# EasyEDA Pro project CogletESP_2026-02-24.epro, schematic CogletESPV1.1_3
Board Name: CogletESPV1.1_3; Create Date: 2025-12-19; Page Name: P1; Project Name: CogletESP; Schematic Name: CogletESPV1.1_3; Update Date: 2026-01-07; Company: EasyEDA.com; Page Size: A4; Version: V1.0
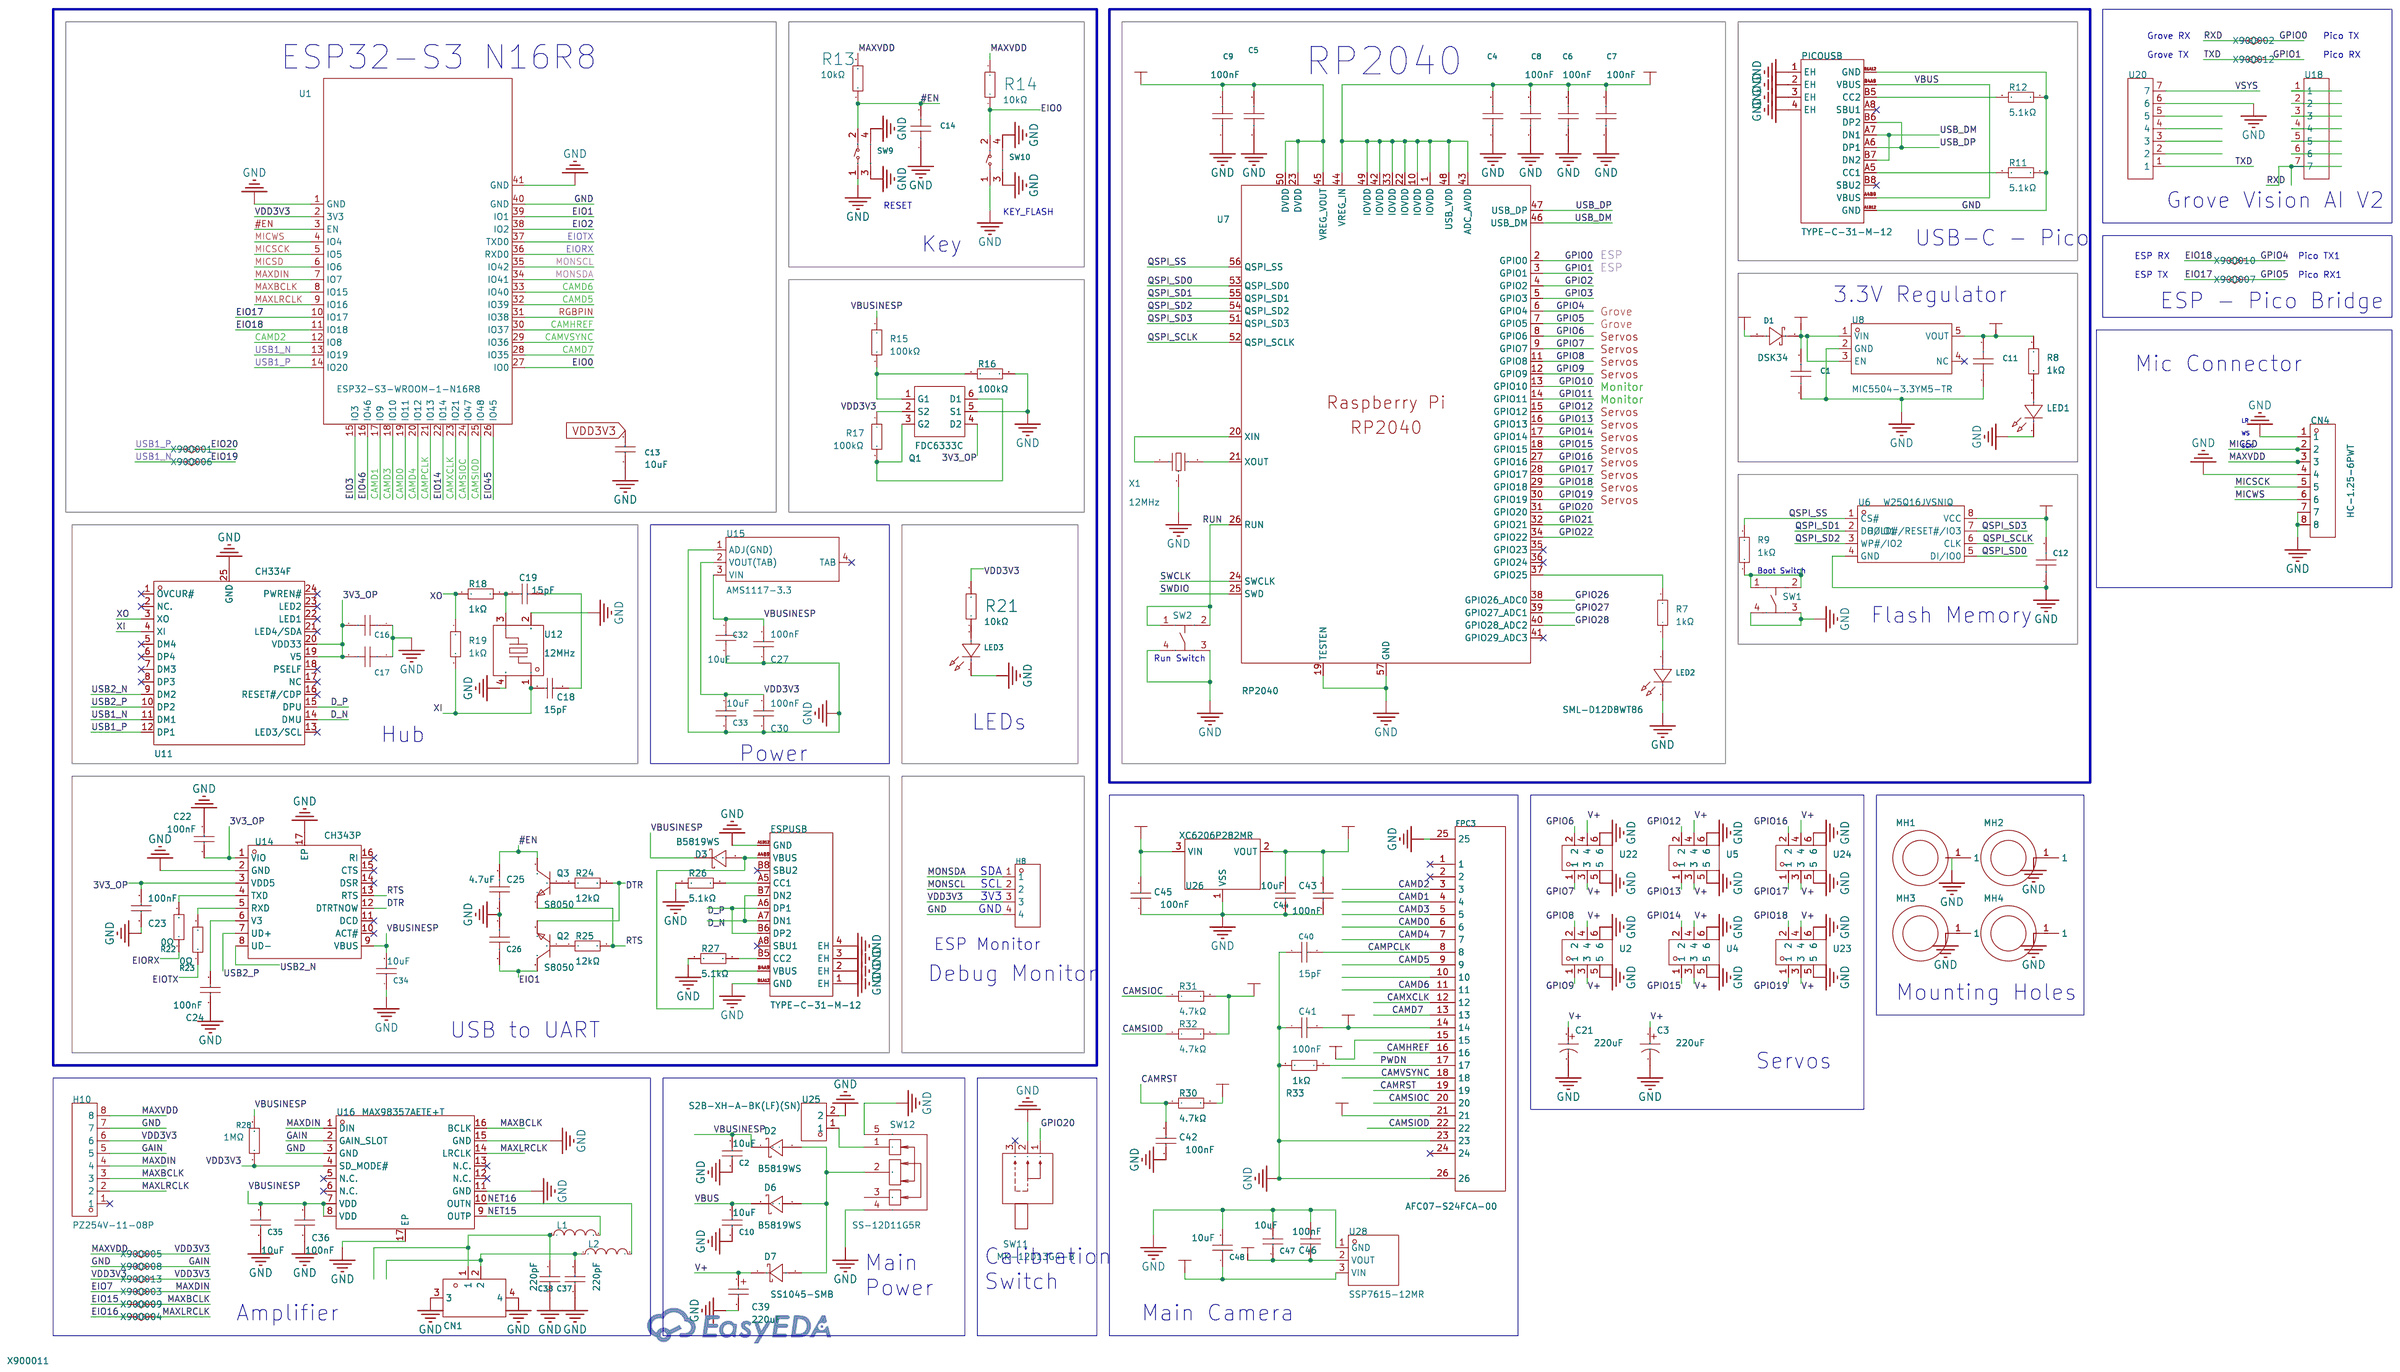
[diagram p2: schematic sheet]

## Parts
C1  1uF  [C0603]
C2  10uF  [C0603]
C3  220uF  [CAP-SMD_BD6.3-L6.6-W6.6-FD]
C4  1uF  [C0603]
C5  1uF  [C0603]
C6  100nF  [C0603]
C7  100nF  [C0603]
C8  100nF  [C0603]
C9  100nF  [C0603]
C10  10uF  [C0603]
C11  1uF  [C0603]
C12  1uF  [C0603]
C13  10uF  [C0805]
C14  1uF  [C0603]
C16  1uF  [C0603]
C17  1uF  [C0603]
C18  15pF  [C0603]
C19  15pF  [C0603]
C21  220uF  [CAP-SMD_BD6.3-L6.6-W6.6-FD]
C22  100nF  [C0603]
C23  100nF  [C0603]
C24  100nF  [C0603]
C25  4.7uF  [C0603]
C26  1uF  [C0603]
C27  100nF  [C0603]
C30  100nF  [C0603]
C32  10uF  [C0603]
C33  10uF  [C0603]
C34  10uF  [C0603]
C35  10uF  [C0603]
C36  100nF  [C0603]
C37  220pF  [C0603]
C38  220pF  [C0603]
C39  220uF  [CASE-B_3528]
C40  15pF  [C0603]
C41  100nF  [C0603]
C42  100nF  [C0603]
C43  100nF  [C0603]
C44  10uF  [C0603]
C45  100nF  [C0603]
C46  100nF  [C0603]
C47  10uF  [C0603]
C48  10uF  [C0603]
CN1  HC-1.25-2PWT  [CONN-SMD_2P-P1.25-HC-1.25-2PWT]
CN4  HC-1.25-6PWT  [CONN-SMD_6P-P1.25_HC-1.25-6PWT]
D1  DSK34  [SOD-123_L2.8-W1.8-LS3.7-RD]
D2  B5819WS  [SOD-323_L1.8-W1.3-LS2.5-RD]
D3  B5819WS  [SOD-323_L1.8-W1.3-LS2.5-RD]
D6  B5819WS  [SOD-323_L1.8-W1.3-LS2.5-RD]
D7  SS1045-SMB  [SMB_L4.4-W3.6-LS5.3-RD]
ESPUSB  TYPE-C-31-M-12  [USB-C_SMD-TYPE-C-31-M-12_1]
FPC3  AFC07-S24FCA-00  [FPC-SMD_AFC07-S24FCA-00]
H8  PZ254V-11-04P  [HDR-TH_4P-P2.54-V-M]
H10  PZ254V-11-08P  [HDR-TH_8P-P2.54-V-M]  (no BOM)
L1  BLM18PG121SN1D  [L0603]
L2  BLM18PG121SN1D  [L0603]
LED1  SML-D12P8WT86  [LED0603-RD_GREEN]
LED2  SML-D12D8WT86  [LED0603-R-RD_AMBER]
LED3  SML-D12D8WT86  [LED0603-R-RD_AMBER]
MH1  -  [2.5mm Mounting Hole]
MH2  -  [2.5mm Mounting Hole]
MH3  -  [2.5mm Mounting Hole]
MH4  -  [2.5mm Mounting Hole]
PICOUSB  TYPE-C-31-M-12  [USB-C_SMD-TYPE-C-31-M-12_1]
Q1  FDC6333C  [SOT-23-6_L2.9-W1.6-P0.95-LS2.8-BL]
Q2  S8050  [SOT-23-3_L3.0-W1.7-P0.95-LS2.9-BR]
Q3  S8050  [SOT-23-3_L3.0-W1.7-P0.95-LS2.9-BR]
R7  1kΩ  [R0603]
R8  1kΩ  [R0603]
R9  1kΩ  [R0603]
R11  5.1kΩ  [R0402]
R12  5.1kΩ  [R0402]
R13  10kΩ  [R0603]
R14  10kΩ  [R0603]
R15  100kΩ  [R0603]
R16  100kΩ  [R0603]
R17  100kΩ  [R0603]
R18  1kΩ  [R0603]
R19  1kΩ  [R0603]  (no BOM)
R21  10kΩ  [R0603]
R22  0Ω  [R0603]
R23  0Ω  [R0603]
R24  12kΩ  [R0603]
R25  12kΩ  [R0603]
R26  5.1kΩ  [R0402]
R27  5.1kΩ  [R0402]
R28  1MΩ  [R0603]
R30  4.7kΩ  [R0603]
R31  4.7kΩ  [R0603]
R32  4.7kΩ  [R0603]
R33  1kΩ  [R0603]
SW1  SKRPACE010  [KEY-SMD_4P-L4.2-W3.2-P2.20-LS4.6]
SW2  SKRPACE010  [KEY-SMD_4P-L4.2-W3.2-P2.20-LS4.6]
SW9  TC-6615-9.5-260G  [SW-TH_4P-L7.5-W9.5-P4.50]
SW10  TC-6615-9.5-260G  [SW-TH_4P-L7.5-W9.5-P4.50]
SW11  MK-12D13G4-B  [SW-TH_MK-12D13G4-B]
SW12  SS-12D11G5R  [SW-TH_SS-12D11G5R]
U1  ESP32-S3-WROOM-1-N16R8  [WIRELM-SMD_ESP32-S3-WROOM-1]
U2  HX PZ2.54-3x2P ZZ  [HDR-TH_6P-P2.54-V-M-R3-C2-S2.54_2]
U4  HX PZ2.54-3x2P ZZ  [HDR-TH_6P-P2.54-V-M-R3-C2-S2.54_2]
U5  HX PZ2.54-3x2P ZZ  [HDR-TH_6P-P2.54-V-M-R3-C2-S2.54_2]
U6  W25Q16JVSNIQ  [SOP-8_L4.9-W3.9-P1.27-LS6.0-BL]
U7  RP2040  [LQFN-56_L7.0-W7.0-P0.4-EP]
U8  MIC5504-3.3YM5-TR  [SOT-23-5_L3.0-W1.7-P0.95-LS2.8-TL]
U11  CH334F  [QFN-24_L4.0-W4.0-P0.50-BL-EP2.8]
U12  12MHz  [CRYSTAL-SMD_4P-L3.2-W2.5-BL]
U14  CH343P  [TQFN-16_L3.0-W3.0-P0.50-BL-EP1.7]
U15  AMS1117-3.3  [SOT-223-4_L6.5-W3.5-P2.30-LS7.0-BR]
U16  MAX98357AETE+T  [TQFN-16_L3.0-W3.0-P0.50-BL-EP1.5]
U18  HB-PH3-25417PB2GOP  [HDR-TH_7P-P2.54-V-M]
U20  HB-PH3-25417PB2GOP  [HDR-TH_7P-P2.54-V-M]  (no BOM)
U22  HX PZ2.54-3x2P ZZ  [HDR-TH_6P-P2.54-V-M-R3-C2-S2.54_2]
U23  HX PZ2.54-3x2P ZZ  [HDR-TH_6P-P2.54-V-M-R3-C2-S2.54_2]
U24  HX PZ2.54-3x2P ZZ  [HDR-TH_6P-P2.54-V-M-R3-C2-S2.54_2]
U25  S2B-XH-A-BK(LF)(SN)  [CONN-TH_S2B-XH-A-LF-SN]
U26  XC6206P282MR  [SOT-23-3_L2.9-W1.3-P0.95-LS2.4-BR]
U28  SSP7615-12MR  [SOT-23-3_L2.9-W1.6-P1.90-LS2.8-BR]
X1  12MHz  [CRYSTAL-SMD_3P-L3.2-W1.3-P1.2-BL]

## Library data of the parts
C1 C4 C5 C11 C12 C14 C16 C17 C26 = CL10A105KB8NNNC: Capacitance: Tolerance:±10% Tolerance:±10% Voltage Rated: Temperature Coefficient:; LCSC Part Name: 1uF ±10% 50V; Supplier Part: C15849; Manufacturer: SAMSUNG(三星); Supplier Footprint: 0603; JLCPCB Part Class: Basic Part; Datasheet: https://atta.szlcsc.com/upload/public/pdf/source/20160218/1457707763339.pdf; Supplier: LCSC; Tolerance: ±10%
C2 C10 C32-C35 C44 C47 C48 = CL10A106MO8NQNC: Capacitance:10uF Tolerance:±20% Tolerance:±20% Voltage Rating:16V Temperature Coefficient:X5R; LCSC Part Name: 10uF ±20% 16V; Supplier Part: C92487; Manufacturer: SAMSUNG(三星); Supplier Footprint: 0603; JLCPCB Part Class: Extended Part; Datasheet: https://item.szlcsc.com/datasheet/CL10A106MO8NQNC/93680.html; Supplier: LCSC; Tolerance: ±20%; Voltage Rating: 16V; Temperature Coefficient: X5R
C3 C21 = RVT1A221M0605_C72494: Capacitance: Tolerance:±20% Tolerance:±20% Voltage Rating: Ripple Current: Equivalent Series Resistance(ESR):- Diameter: Height - Seated (Max): Lifetime:2000hrs@105℃ Operating Temperature:-40℃~+105℃ Operating Temperature:-40℃~+105℃; LCSC Part Name: 220uF ±20% 10V; Supplier Part: C72494; Manufacturer: ROQANG(容强); Manufacturer Part: RVT1A221M0605; Supplier Footprint: SMD,D6.3xL5.4mm; JLCPCB Part Class: Extended Part; Datasheet: https://atta.szlcsc.com/upload/public/pdf/source/20170325/1490427950282.pdf; Supplier: LCSC; Tolerance: ±20%; Lifetime: 2000hrs@105℃; Operating Temperature: -40℃~+105℃
C6-C9 = CC0603KRX7R9BB104: Capacitance:100nF Tolerance:±10% Tolerance:±10% Voltage Rating:50V Temperature Coefficient:X7R; LCSC Part Name: 100nF ±10% 50V; Supplier Part: C14663; Manufacturer: YAGEO(国巨); Supplier Footprint: 0603; JLCPCB Part Class: Basic Part; Datasheet: https://item.szlcsc.com/datasheet/CC0603KRX7R9BB104/15331.html; Supplier: LCSC; Tolerance: ±10%; Temperature Coefficient: X7R; Voltage Rating: 50V
C13 = CL21A106KOQNNNE: Capacitance:10uF Tolerance:±10% Tolerance:±10% Voltage Rating:16V Temperature Coefficient:X5R; LCSC Part Name: 10uF ±10% 16V; Supplier Part: C1713; Manufacturer: SAMSUNG(三星); Supplier Footprint: 0805; JLCPCB Part Class: Extended Part; Datasheet: https://item.szlcsc.com/datasheet/CL21A106KOQNNNE/2065.html; Supplier: LCSC; Tolerance: ±10%; Voltage Rating: 16V; Temperature Coefficient: X5R
C18 C19 = CL10C150JB8NNNC: Capacitance:15pF Tolerance:±5% Tolerance:±5% Voltage Rating:50V Temperature Coefficient:C0G; LCSC Part Name: 15pF ±5% 50V; Supplier Part: C1644; Manufacturer: SAMSUNG(三星); Supplier Footprint: 0603; JLCPCB Part Class: Basic Part; Datasheet: https://item.szlcsc.com/datasheet/CL10C150JB8NNNC/1996.html; Supplier: LCSC; Tolerance: ±5%; Voltage Rating: 50V; Temperature Coefficient: C0G
C22-C24 C27 C30 C36 C41-C43 C45 C46 = CL10B104KA8NNNC: Capacitance:100nF Tolerance:±10% Tolerance:±10% Voltage Rating:25V Temperature Coefficient:X7R; LCSC Part Name: 100nF ±10% 25V; Supplier Part: C1590; Manufacturer: SAMSUNG(三星); Supplier Footprint: 0603; JLCPCB Part Class: Extended Part; Datasheet: https://item.szlcsc.com/datasheet/CL10B104KA8NNNC/1942.html; Supplier: LCSC; Tolerance: ±10%; Voltage Rating: 25V; Temperature Coefficient: X7R
C25 = CL10A475KO8NNNC: Capacitance:4.7uF Tolerance:±10% Tolerance:±10% Voltage Rating:16V Temperature Coefficient:X5R; LCSC Part Name: 4.7uF ±10% 16V; Supplier Part: C19666; Manufacturer: SAMSUNG(三星); Supplier Footprint: 0603; JLCPCB Part Class: Basic Part; Datasheet: https://item.szlcsc.com/datasheet/CL10A475KO8NNNC/20375.html; Supplier: LCSC; Tolerance: ±10%; Voltage Rating: 16V; Temperature Coefficient: X5R
C37 C38 = CL10B221KB8NNNC: Capacitance:220pF Tolerance:±10% Tolerance:±10% Voltage Rating:50V Temperature Coefficient:X7R; LCSC Part Name: 220pF ±10% 50V; Supplier Part: C1603; Manufacturer: SAMSUNG(三星); Supplier Footprint: 0603; JLCPCB Part Class: Basic Part; Datasheet: https://item.szlcsc.com/datasheet/CL10B221KB8NNNC/1955.html; Supplier: LCSC; Tolerance: ±10%; Voltage Rating: 50V; Temperature Coefficient: X7R
C39 = TLJB227M006R0500: Capacitance:220uF Tolerance:±20% Tolerance:±20% Voltage Rating:6.3V Equivalent Series Resistance(ESR):500mΩ@100kHz Operating Temperature:-55℃~+125℃ Operating Temperature:-55℃~+125℃; LCSC Part Name: 220uF ±20% 6.3V; Supplier Part: C30242; Manufacturer: Kyocera AVX; Supplier Footprint: CASE-B-3528-21(mm); JLCPCB Part Class: Extended Part; Supplier: LCSC; Tolerance: ±20%; Voltage Rating: 6.3V; Equivalent Series Resistance(ESR): 500mΩ@100kHz; Operating Temperature: -55℃~+125℃
C40 = CC0603JRNPO9BN150: Capacitance:15pF Tolerance:±5% Tolerance:±5% Voltage Rating:50V Temperature Coefficient:NP0; LCSC Part Name: 15pF ±5% 50V; Supplier Part: C107037; Manufacturer: YAGEO(国巨); Supplier Footprint: 0603; JLCPCB Part Class: Extended Part; Datasheet: https://item.szlcsc.com/datasheet/CC0603JRNPO9BN150/108253.html; Supplier: LCSC; Tolerance: ±5%; Voltage Rating: 50V; Temperature Coefficient: NP0
CN1 = HC-1.25-2PWT: Pins Structure:1x2P Pitch:1.25mm Mounting Style:Horizontal attachment Reference Series:PicoBlade(MX 1.25) Number of Pins:2P Number of Rows:1 Number of PINs Per Row:2 Row Spacing:- Current Rating (Max):1A Contact Material:Brass Contact Plating:Tin Operatin; LCSC Part Name: 1x2P 间距:1.25mm 卧贴 系列:PicoBlade(MX 1.25); Supplier Part: C2845379; Manufacturer: HCTL(华灿天禄); Supplier Footprint: SMD,P=1.25mm,卧贴; JLCPCB Part Class: Extended Part; Datasheet: https://atta.szlcsc.com/upload/public/pdf/source/20240930/9508A8292CCC87B0C29E3A028D56E30A.pdf; Supplier: LCSC; Pins Structure: 1x2P; Pitch: 1.25mm; Mounting Style: Horizontal attachment; Reference Series: PicoBlade(MX 1.25); Number of Pins: 2P; Number of Rows: 1; Number of PINs Per Row: 2; Current Rating (Max): 1A; Contact Material: Brass; Contact Plating: Tin; Operating Temperature Range: -40℃~+105℃; Rated Voltage (Max): 125V; Plastic Material: LCP; Flame Retardant Rating: UL94V-0; Supplementary Features: Auxiliary soldering legs; Z-Height of the Board: 3.57mm; X-Length of Bottom Edge on Board (Spacing Line): 7.55mm; Y-Width of Bottom Edge on Board: 5.25mm
CN4 = HC-1.25-6PWT: Pins Structure:1x6P Pitch:1.25mm Mounting Type:Surface Mount, Right Angle Reference Series:PicoBlade(MX 1.25) Number of Pins:6P Number of Rows:1 Number of PINs Per Row:6 Row Spacing:- Current Rating:1A Contact Material:Brass Contact Plating:Tin Operating; LCSC Part Name: 1x6P 间距:1.25mm 卧贴 系列:PicoBlade(MX 1.25); Supplier Part: C2845383; Manufacturer: HCTL(华灿天禄); Supplier Footprint: SMD,P=1.25mm,卧贴; JLCPCB Part Class: Extended Part; Datasheet: https://item.szlcsc.com/datasheet/HC-1.25-6PWT/3039064.html; Supplier: LCSC; Pins Structure: 1x6P; Pitch: 1.25mm; Mounting Type: Surface Mount, Right Angle; Reference Series: PicoBlade(MX 1.25); Number of Pins: 6P; Number of Rows: 1; Number of PINs Per Row: 6; Current Rating: 1A; Contact Material: Brass; Contact Plating: Tin; Operating Temperature: -40℃~+105℃; Voltage Rating: 125V; Plastic Material: LCP; Flame Retardant Rating: UL94V-0; Supplementary Features: Auxiliary Solder Pin; Z-Height of the Board: 3.57mm; X-Length of Bottom Edge on Board (Spacing Line): 12.55mm; Y-Width of Bottom Edge on Board: 5.25mm
D1 = DSK34_C41029: Diode Configuration:Independent Type Forward Voltage (Vf@If):550mV@3A Reverse Voltage (Vr):40V Rectified Current:3A Reverse Leakage Current (Ir):500uA@40V; LCSC Part Name: 电压:40V 电流:3A; Supplier Part: C41029; Manufacturer: MDD(辰达半导体); Supplier Footprint: SOD-123FL; JLCPCB Part Class: Extended Part; Datasheet: https://atta.szlcsc.com/upload/public/pdf/source/20240710/931B7979AEEE628A0AE48522F9F6A0BB.pdf; Supplier: LCSC; Diode Configuration: Independent Type; Forward Voltage (Vf@If): 550mV@3A; Reverse Voltage (Vr): 40V; Rectified Current: 3A; Reverse Leakage Current (Ir): 500uA@40V
D2 D3 D6 = B5819WS_C64886: Diode Configuration:Independent Voltage - Forward(Vf@If):900mV@3A Voltage - DC Reverse(Vr):40V Current - Rectified:1A Reverse Leakage Current (Ir):1mA@40V Operating Junction Temperature Range:-55℃~+125℃ Operating Junction Temperature Range:-55℃~+125℃ Non-; LCSC Part Name: 丝印SL 电压:40V 电流:1A; Supplier Part: C64886; Manufacturer: MDD(辰达半导体); Supplier Footprint: SOD-323; JLCPCB Part Class: Extended Part; Datasheet: https://item.szlcsc.com/datasheet/B5819WS/65956.html; Supplier: LCSC; Diode Configuration: Independent; Voltage - Forward(Vf@If): 900mV@3A; Voltage - DC Reverse(Vr): 40V; Current - Rectified: 1A; Reverse Leakage Current (Ir): 1mA@40V; Operating Junction Temperature Range: -55℃~+125℃; Non-Repetitive Peak Forward Surge Current: 25A
D7 = SS1045-SMB: Diode Configuration:Independent Type Voltage - Forward(Vf@If):550mV@10A Voltage - DC Reverse(Vr):45V Current - Rectified:10A Reverse Leakage Current (Ir):100nA; LCSC Part Name: 电压:45V 电流:10A; Supplier Part: C2903947; Manufacturer: GOODWORK(固得沃克); Supplier Footprint: SMB(DO-214AA); JLCPCB Part Class: Extended Part; Datasheet: https://atta.szlcsc.com/upload/public/pdf/source/20240617/4C132C80E36BDBE9AB2C039856844535.pdf; Supplier: LCSC; Diode Configuration: Independent Type; Voltage - Forward(Vf@If): 550mV@10A; Voltage - DC Reverse(Vr): 45V; Current - Rectified: 10A; Reverse Leakage Current (Ir): 100nA
ESPUSB PICOUSB = TYPE-C-31-M-12: Connector Type:Type-C Protocol Standard:- Gender:Female Mounting Type:- Number of Contacts:16P Number of Ports:1 Current Rating-Power:5A Operating Temperature:- Operating Temperature:-; LCSC Part Name: Type-C 母; Supplier Part: C165948; Manufacturer: 韩国韩荣; Supplier Footprint: SMD; JLCPCB Part Class: Extended Part; Datasheet: https://item.szlcsc.com/datasheet/TYPE-C-31-M-12/177331.html; Supplier: LCSC; Connector Type: Type-C; Gender: Female; Number of Contacts: 16P; Number of Ports: 1; Current Rating-Power: 5A
FPC3 = AFC07-S24FCA-00: Locking Feature:Slide Lock Contact Type:Bottom Contact Number of Contacts:24P Pitch:0.5mm Mounting Type:Surface Mount, Right Angle FFC, FCB Thickness:0.3mm FFC, FCB Thickness:0.3mm Height Above Board:2mm Contact Material:Copper Alloy Contact Plating:Tin; LCSC Part Name: 抽屉式 下接 P数:24P 间距:0.5mm; Supplier Part: C262567; Manufacturer: JS(钜硕电子); Supplier Footprint: SMD,P=0.5mm,卧贴; JLCPCB Part Class: Extended Part; Datasheet: https://item.szlcsc.com/datasheet/AFC07-S24FCA-00/253876.html; Supplier: LCSC; Locking Feature: Slide Lock; Contact Type: Bottom Contact; Number of Contacts: 24P; Pitch: 0.5mm; Mounting Type: Surface Mount, Right Angle; FFC, FCB Thickness: 0.3mm; Height Above Board: 2mm; Contact Material: Copper Alloy; Contact Plating: Tin
H8 = PZ254V-11-04P: Pin Structure:1x4P Pitch:2.54mm Row Spacing:- Circluar Pins/Square Pins:Pin Header Mounting Type:Through Hole Number of Rows:1 Number of Pins:4P Current Rating:3A Voltage Rating (Max):250V Length of Mating Pin:6mm Insulation Height:2.5mm Length of End Con; LCSC Part Name: 1x4P 间距:2.54mm 方针 直插; Supplier Part: C2691448; Manufacturer: XFCN(兴飞); Supplier Footprint: 插件,P=2.54mm; JLCPCB Part Class: Extended Part; Datasheet: https://item.szlcsc.com/datasheet/PZ254V-11-04P/2801085.html; Supplier: LCSC; Pin Structure: 1x4P; Pitch: 2.54mm; Circluar Pins/Square Pins: Pin Header; Mounting Type: Through Hole; Number of Rows: 1; Number of Pins: 4P; Current Rating: 3A; Voltage Rating (Max): 250V; Length of Mating Pin: 6mm; Insulation Height: 2.5mm; Length of End Connection Pin: 3mm; Operating Temperature: -40℃~+105℃; Color: Black
H10 = PZ254V-11-08P: Pin Structure:1x8P Pitch:2.54mm Row Spacing:- Circluar Pins/Square Pins:Pin Header Mounting Type:Through Hole Number of Rows:1 Number of Pins:8P Current Rating:- Voltage Rating (Max):- Length of Mating Pin:6mm Insulation Height:2.5mm Length of End Connect; LCSC Part Name: 1x8P 间距:2.54mm 方针 直插; Supplier Part: C492407; Manufacturer: XFCN(兴飞); Supplier Footprint: 插件,P=2.54mm; JLCPCB Part Class: Extended Part; Datasheet: https://item.szlcsc.com/datasheet/PZ254V-11-08P/502963.html; Supplier: LCSC; Pin Structure: 1x8P; Pitch: 2.54mm; Circluar Pins/Square Pins: Pin Header; Mounting Type: Through Hole; Number of Rows: 1; Number of Pins: 8P; Length of Mating Pin: 6mm; Insulation Height: 2.5mm; Length of End Connection Pin: 3mm; Contact Material: Brass; Operating Temperature: -40℃~+105℃; Color: Black
L1 L2 = BLM18PG121SN1D_C14709: Impedance @ Frequency:120Ω@100MHz Tolerance:±25% Tolerance:±25% DC Resistance(DCR):50mΩ Current Rating:2A Number of Circuits:1 Operating Temperature:-55℃~+125℃ Operating Temperature:-55℃~+125℃; LCSC Part Name: 单路 0603磁珠 阻抗120Ω@100MHz; Supplier Part: C14709; Manufacturer: muRata(村田); Supplier Footprint: 0603; JLCPCB Part Class: Basic Part; Datasheet: https://item.szlcsc.com/datasheet/BLM18PG121SN1D/15379.html; Supplier: LCSC; Impedance @ Frequency: 120Ω@100MHz; Tolerance: ±25%; DC Resistance(DCR): 50mΩ; Current Rating: 2A; Number of Circuits: 1; Operating Temperature: -55℃~+125℃
LED1 = SML-D12P8WT86: Emitted Color:Green-yellow Forward Voltage (VF):2.2V Forward Voltage (VF):2.2V Power Dissipation:54mW Forward Current:20mA Dominant Wavelength:560nm Dominant Wavelength:560nm Peak Wavelength:- Diode Configuration:- Lens Color:白色透镜 Color Temperature:- Colo; LCSC Part Name: 普绿/黄绿; Supplier Part: C510026; Manufacturer: ROHM(罗姆); Supplier Footprint: 0603; JLCPCB Part Class: Extended Part; Datasheet: https://atta.szlcsc.com/upload/public/pdf/source/20201028/C510025_17C36021E4F76BF48F6AD66EDB30A43C.pdf; Supplier: LCSC; Emitted Color: Green-yellow; Forward Voltage (VF): 2.2V; Power Dissipation: 54mW; Forward Current: 20mA; Dominant Wavelength: 560nm; Lens Color: 白色透镜; Luminous Intensity: 6.3mcd; Operating Temperature: -40℃~+85℃
LED2 LED3 = SML-D12D8WT86: Emitted Color:Amber Color Forward Voltage (VF):2.2V Forward Voltage (VF):2.2V Power Dissipation:54mW Forward Current:20mA Dominant Wavelength:605nm Dominant Wavelength:605nm Peak Wavelength:- Diode Configuration:- Lens Color:白色透镜 Color Temperature:- Color; LCSC Part Name: 琥珀; Supplier Part: C510024; Manufacturer: ROHM(罗姆); Supplier Footprint: 0603; JLCPCB Part Class: Extended Part; Datasheet: https://atta.szlcsc.com/upload/public/pdf/source/20201028/C510025_17C36021E4F76BF48F6AD66EDB30A43C.pdf; Supplier: LCSC; Emitted Color: Amber Color; Forward Voltage (VF): 2.2V; Power Dissipation: 54mW; Forward Current: 20mA; Dominant Wavelength: 605nm; Lens Color: 白色透镜; Luminous Intensity: 100mcd; Operating Temperature: -40℃~+85℃
MH1-MH4 = 2.5mmHole
Q1 = FDC6333C_C5182070: Drain to Source Voltage:30V；30V Current - Continuous Drain(Id):4A；3A RDS(on):30mΩ@10V；45mΩ@10V Gate Threshold Voltage (Vgs(th)):1.6V@250uA；1.5V@250uA Gate Charge(Qg):5nC@10V；5nC@10V Input Capacitance(Ciss):199pF；210pF Reverse Transfer Capacitance (Crss@Vd; LCSC Part Name: N沟道和P沟道增强型功率MOSFET; Supplier Part: C5182070; Manufacturer: TECH PUBLIC(台舟); Supplier Footprint: SOT-23-6; JLCPCB Part Class: Extended Part; Datasheet: https://item.szlcsc.com/datasheet/FDC6333C/5842210.html; Supplier: LCSC; Drain to Source Voltage: 30V；30V; Current - Continuous Drain(Id): 4A；3A; RDS(on): 30mΩ@10V；45mΩ@10V; Gate Threshold Voltage (Vgs(th)): 1.6V@250uA；1.5V@250uA; Gate Charge(Qg): 5nC@10V；5nC@10V; Input Capacitance(Ciss): 199pF；210pF; Reverse Transfer Capacitance (Crss@Vds): 23pF；28pF; Operating Temperature: -55℃~+150℃; Type: N-Channel + P-Channel; Output Capacitance(Coss): 35pF；47pF
Q2 Q3 = S8050 J3Y(RANGE:200-350): type:NPN Current - Collector(Ic):500mA Collector - Emitter Voltage VCEO:25V Pd - Power Dissipation:300mW DC Current Gain:200@500mA,1V DC Current Gain:200@500mA,1V Transition frequency(fT):150MHz Current - Collector Cutoff:100nA Vce Saturation(VCE(sat)):60; LCSC Part Name: H档(200-350) NPN 电流:0.5A 电压:25V; Supplier Part: C2146; Manufacturer: CJ(江苏长电/长晶); Supplier Footprint: SOT-23; JLCPCB Part Class: Basic Part; Datasheet: https://item.szlcsc.com/datasheet/S8050%2520J3Y(RANGE%253A200-350)/2503.html; Supplier: LCSC; type: NPN; Current - Collector(Ic): 500mA; Collector - Emitter Voltage VCEO: 25V; Pd - Power Dissipation: 300mW; DC Current Gain: 200@500mA,1V; Transition frequency(fT): 150MHz; Current - Collector Cutoff: 100nA; Vce Saturation(VCE(sat)): 600mV@500mA,50mA; Operating Temperature: -55℃~+150℃; Emitter-Base Voltage(Vebo): 5V; Number: 1 NPN
R7-R9 R18 R19 R33 = RC0603JR-071KL: Type:Thick Film Resistors Resistance: Tolerance:±5% Tolerance:±5% Power(Watts): Overload Voltage (Max): Temperature Coefficient:±100ppm/℃ Temperature Coefficient:±100ppm/℃ Operating Temperature Range:-55℃~+155℃ Operating Temperature Range:-55℃~+155℃; LCSC Part Name: 厚膜电阻 1kΩ ±5% 100mW; Supplier Part: C14676; Manufacturer: YAGEO(国巨); Supplier Footprint: 0603; JLCPCB Part Class: Extended Part; Datasheet: https://atta.szlcsc.com/upload/public/pdf/source/20180312/878C51D17DCD6F9A3FE54FC2E3312A77.pdf; Supplier: LCSC; Type: Thick Film Resistors; Tolerance: ±5%; Temperature Coefficient: ±100ppm/℃; Operating Temperature Range: -55℃~+155℃
R11 R12 R26 R27 = 0402WGF5101TCE: Type:Thick Film Resistors Resistance:5.1kΩ Tolerance:±1% Tolerance:±1% Power(Watts): Overload Voltage (Max): Temperature Coefficient:±100ppm/℃ Temperature Coefficient:±100ppm/℃ Operating Temperature Range:-55℃~+155℃ Operating Temperature Range:-55℃~+155℃; LCSC Part Name: 5.1kΩ ±1% 62.5mW 厚膜电阻; Supplier Part: C25905; Manufacturer: UNI-ROYAL(厚声); Supplier Footprint: 0402; JLCPCB Part Class: Basic Part; Datasheet: https://atta.szlcsc.com/upload/public/pdf/source/20200306/C422600_1E6D84923E4A46A82E41ADD87F860B5C.pdf; Supplier: LCSC; Type: Thick Film Resistors; Tolerance: ±1%; Temperature Coefficient: ±100ppm/℃; Operating Temperature Range: -55℃~+155℃
R13 R14 R21 = 0603WAF1002T5E: Type:Thick Film Resistor Resistance:10kΩ Tolerance:±1% Tolerance:±1% Power(Watts):100mW Voltage-Supply(Max):75V Temperature Coefficient:±100ppm/℃ Temperature Coefficient:±100ppm/℃ Operating Temperature:-55℃~+155℃ Operating Temperature:-55℃~+155℃; LCSC Part Name: 厚膜电阻 10kΩ ±1% 100mW; Supplier Part: C25804; Manufacturer: UNI-ROYAL(厚声); Supplier Footprint: 0603; JLCPCB Part Class: Basic Part; Datasheet: https://item.szlcsc.com/datasheet/0603WAF1002T5E/26547.html; Supplier: LCSC; Type: Thick Film Resistor; Tolerance: ±1%; Power(Watts): 100mW; Voltage-Supply(Max): 75V; Temperature Coefficient: ±100ppm/℃; Operating Temperature: -55℃~+155℃
R15-R17 = 0603WAF1003T5E: Type:Thick Film Resistor Resistance:100kΩ Tolerance:±1% Tolerance:±1% Power(Watts):100mW Voltage-Supply(Max):75V Temperature Coefficient:±100ppm/℃ Temperature Coefficient:±100ppm/℃ Operating Temperature:-55℃~+155℃ Operating Temperature:-55℃~+155℃; LCSC Part Name: 100kΩ ±1% 100mW 厚膜电阻; Supplier Part: C25803; Manufacturer: UNI-ROYAL(厚声); Supplier Footprint: 0603; JLCPCB Part Class: Basic Part; Datasheet: https://item.szlcsc.com/datasheet/0603WAF1003T5E/26546.html; Supplier: LCSC; Type: Thick Film Resistor; Tolerance: ±1%; Power(Watts): 100mW; Voltage-Supply(Max): 75V; Temperature Coefficient: ±100ppm/℃; Operating Temperature: -55℃~+155℃
R22 R23 = 0603WAJ0000T5E: Type:Thick Film Resistor Resistance:0Ω Tolerance:±5% Tolerance:±5% Power(Watts):100mW Voltage-Supply(Max):75V Temperature Coefficient:±800ppm/℃ Temperature Coefficient:±800ppm/℃ Operating Temperature:-55℃~+155℃ Operating Temperature:-55℃~+155℃; LCSC Part Name: 0Ω ±5% 100mW 厚膜电阻; Supplier Part: C15402; Manufacturer: UNI-ROYAL(厚声); Supplier Footprint: 0603; JLCPCB Part Class: Extended Part; Datasheet: https://item.szlcsc.com/datasheet/0603WAJ0000T5E/16080.html; Supplier: LCSC; Type: Thick Film Resistor; Tolerance: ±5%; Power(Watts): 100mW; Voltage-Supply(Max): 75V; Temperature Coefficient: ±800ppm/℃; Operating Temperature: -55℃~+155℃
R24 R25 = 0603WAF1202T5E: Type:Thick Film Resistor Resistance:12kΩ Tolerance:±1% Tolerance:±1% Power(Watts):100mW Voltage-Supply(Max):75V Temperature Coefficient:±100ppm/℃ Temperature Coefficient:±100ppm/℃ Operating Temperature:-55℃~+155℃ Operating Temperature:-55℃~+155℃; LCSC Part Name: 12kΩ ±1% 100mW 厚膜电阻; Supplier Part: C22790; Manufacturer: UNI-ROYAL(厚声); Supplier Footprint: 0603; JLCPCB Part Class: Basic Part; Datasheet: https://item.szlcsc.com/datasheet/0603WAF1202T5E/23517.html; Supplier: LCSC; Type: Thick Film Resistor; Tolerance: ±1%; Power(Watts): 100mW; Voltage-Supply(Max): 75V; Temperature Coefficient: ±100ppm/℃; Operating Temperature: -55℃~+155℃
R28 = 0603WAF1004T5E: Type:Thick Film Resistors Resistance:1MΩ Tolerance:±1% Tolerance:±1% Power(Watts): Overload Voltage (Max): Temperature Coefficient:±100ppm/℃ Temperature Coefficient:±100ppm/℃ Operating Temperature Range:-55℃~+155℃ Operating Temperature Range:-55℃~+155℃; LCSC Part Name: 1MΩ ±1% 100mW 厚膜电阻; Supplier Part: C22935; Manufacturer: UNI-ROYAL(厚声); Supplier Footprint: 0603; JLCPCB Part Class: Basic Part; Datasheet: https://atta.szlcsc.com/upload/public/pdf/source/20200306/C422600_1E6D84923E4A46A82E41ADD87F860B5C.pdf; Supplier: LCSC; Type: Thick Film Resistors; Tolerance: ±1%; Temperature Coefficient: ±100ppm/℃; Operating Temperature Range: -55℃~+155℃
R30-R32 = 0603WAF4701T5E: Type:Thick Film Resistor Resistance:4.7kΩ Tolerance:±1% Tolerance:±1% Power(Watts):100mW Voltage-Supply(Max):75V Temperature Coefficient:±100ppm/℃ Temperature Coefficient:±100ppm/℃ Operating Temperature:-55℃~+155℃ Operating Temperature:-55℃~+155℃; LCSC Part Name: 4.7kΩ ±1% 100mW 厚膜电阻; Supplier Part: C23162; Manufacturer: UNI-ROYAL(厚声); Supplier Footprint: 0603; JLCPCB Part Class: Basic Part; Datasheet: https://item.szlcsc.com/datasheet/0603WAF4701T5E/23889.html; Supplier: LCSC; Type: Thick Film Resistor; Tolerance: ±1%; Power(Watts): 100mW; Voltage-Supply(Max): 75V; Temperature Coefficient: ±100ppm/℃; Operating Temperature: -55℃~+155℃
SW1 SW2 = SKRPACE010: Circuit:SPST Actuator Style:Oval button Mounting Style:Brick nogging Switch Length:4.2mm Switch Width:3.2mm Switch Height:2.5mm Contact Current:50mA Voltage Rating (DC):16V With Lamp:- Mechanical Life:-; LCSC Part Name: 4.2*3.2*2.5mm 立贴 轻触开关; Supplier Part: C139797; Manufacturer: ALPSALPINE(阿尔卑斯阿尔派); Supplier Footprint: SMD; JLCPCB Part Class: Extended Part; Datasheet: https://atta.szlcsc.com/upload/public/pdf/source/20171113/C139797_15105612676371115729.pdf; Supplier: LCSC; Circuit: SPST; Actuator Style: Oval button; Mounting Style: Brick nogging; Switch Length: 4.2mm; Switch Width: 3.2mm; Switch Height: 2.5mm; Contact Current: 50mA; Voltage Rating (DC): 16V
SW9 SW10 = TC-6615-9.5-260G: Circuit:SPST Actuator Style:Round Button Operating Force:2.6N Mounting Type:Right Angle Length:6mm Width:6mm Switch Height:9.5mm with Bracket:With Bracket Contact Current:50mA Voltage Rating:12V Actuator/Cap Color:Black With Lamp:No IP Rating:- Terminatio; LCSC Part Name: 轻触6*6*9.5支架 插件260g; Supplier Part: C2845278; Manufacturer: HCTL(华灿天禄); Supplier Footprint: 插件; JLCPCB Part Class: Extended Part; Datasheet: https://item.szlcsc.com/datasheet/TC-6615-9.5-260G/3038945.html; Supplier: LCSC; Circuit: SPST; Actuator Style: Round Button; Operating Force: 2.6N; Mounting Type: Right Angle; Length: 6mm; Width: 6mm; Switch Height: 9.5mm; with Bracket: With Bracket; Contact Current: 50mA; Voltage Rating: 12V; Actuator/Cap Color: Black; With Lamp: No; Life: 100,000 Cycles; Operating Temperature: -25℃~+85℃
SW11 = MK-12D13G4-B: Circuit:SPDT Actuator Style:Rectangular Columnar Termination Style:PC Pin Length:8.5mm Width:3.5mm Mounting Type:Right Angle Current Rating:300mA Voltage Rating:12V Life:10,000 Cycles; LCSC Part Name: mini拨动开关; Supplier Part: C20611678; Manufacturer: HOOYA(皓宇电子); Supplier Footprint: 插件,P=2.5mm; JLCPCB Part Class: Extended Part; Datasheet: https://item.szlcsc.com/datasheet/MK-12D13G4-B/21966525.html; Supplier: LCSC; Circuit: SPDT; Actuator Style: Rectangular Columnar; Termination Style: PC Pin; Length: 8.5mm; Width: 3.5mm; Mounting Type: Right Angle; Current Rating: 300mA; Voltage Rating: 12V; Life: 10,000 Cycles
SW12 = SS-12D11G5R: Circuit:SPDT Actuator Style:Rectangular Columnar Termination Style:PC Pin Length:- Width:- Switch Height:- Mounting Type:Right Angle Actuator Color:Black Current Rating:3A Voltage Rating:125V Life:10,000 Cycles Operating Temperature:-40℃~+85℃ Operating Te; LCSC Part Name: 柄长5mm 弯插双档 滑动开关; Supplier Part: C388633; Manufacturer: XKB Connection(中国星坤); Supplier Footprint: 插件; JLCPCB Part Class: Extended Part; Datasheet: https://item.szlcsc.com/datasheet/SS-12D11G5R/363903.html; Supplier: LCSC; Circuit: SPDT; Actuator Style: Rectangular Columnar; Termination Style: PC Pin; Mounting Type: Right Angle; Actuator Color: Black; Current Rating: 3A; Voltage Rating: 125V; Life: 10,000 Cycles; Operating Temperature: -40℃~+85℃
U1 = ESP32-S3-WROOM-1-N16R8: LCSC Part Name: 通用型Wi-Fi+低功耗蓝牙MCU模组; Supplier Part: C2913202; Manufacturer: ESPRESSIF(乐鑫); Supplier Footprint: SMD,25.5x18mm; JLCPCB Part Class: Extended Part; Datasheet: https://item.szlcsc.com/datasheet/ESP32-S3-WROOM-1-N16R8/3198300.html; Supplier: LCSC
U2 U4 U5 U22-U24 = HX PZ2.54-3x2P ZZ: Pin Structure:3x2P Pitch:2.54mm Row Spacing:2.54mm Circluar Pins/Square Pins:Pin Header Mounting Type:Through Hole Number of Rows:3 Number of Pins:6P Current Rating:3A Voltage Rating (Max):1kV Length of Mating Pin:6mm Insulation Height:2.5mm Length of End; LCSC Part Name: 3x2P 间距:2.54mm 方针 直插; Supplier Part: C32713289; Manufacturer: hanxia(韩下); Supplier Footprint: 插件,P=2.54mm; JLCPCB Part Class: Extended Part; Datasheet: https://item.szlcsc.com/datasheet/HX%2520PZ2.54-3x2P%2520ZZ/34444569.html; Supplier: LCSC; Pin Structure: 3x2P; Pitch: 2.54mm; Row Spacing: 2.54mm; Circluar Pins/Square Pins: Pin Header; Mounting Type: Through Hole; Number of Rows: 3; Number of Pins: 6P; Current Rating: 3A; Voltage Rating (Max): 1kV; Length of Mating Pin: 6mm; Insulation Height: 2.5mm; Length of End Connection Pin: 3mm; Contact Material: Brass; Contact Plating: Gold; Operating Temperature: -40℃~+105℃; Color: Black
U6 = W25Q16JVSNIQ_C2456211: Supplier Part: C2456211; Manufacturer: WINBOND(华邦); Supplier Footprint: SOIC-8; JLCPCB Part Class: Extended Part; Datasheet: https://atta.szlcsc.com/upload/public/pdf/source/20190529/C115407_78E5B4F96E7138D299EC51EC5982A1A5.pdf; Supplier: LCSC
U7 = RP2040_C2040: CPU Core:- RAM Size:264KB GPIO Ports Number:30 Operating Voltage Range:- Operating Voltage Range:- CPU Maximum Speed:133MHz Program Memory Type:- Operating Temperature Range:- Operating Temperature Range:- ADC (Bit):12bit DAC (Bit):- PWM (Bit):- 8Bit Time; LCSC Part Name: RP2040（RP2B2）; Supplier Part: C2040; Manufacturer: Raspberry Pi(树莓派); Supplier Footprint: LQFN-56(7x7); JLCPCB Part Class: Extended Part; Datasheet: https://atta.szlcsc.com/upload/public/pdf/source/20210621/C2040_96F425825606B7957D87DD32E2512CA9.pdf; Supplier: LCSC; RAM Size: 264KB; GPIO Ports Number: 30; CPU Maximum Speed: 133MHz; ADC (Bit): 12bit; UART/USART: 2; I2C: 2; SPI: 2; Universal Serial Bus: 有; Peripheral/Function: DMA；PWM; Direct Memory Access: 有
U8 = MIC5504-3.3YM5-TR: Output Type: Maximum Input Voltage:5.5V Output Voltage:3.3V Output Voltage:3.3V MAX Output Current:300mA Power Supply Rejection Ratio (PSRR):60dB@(1kHz) Dropout Voltage:380mV@(300mA) standby current:55uA Operating Temperature:-40℃~+125℃ Operating Temperat; LCSC Part Name: 输入5.5V 输出3.3V 300mA; Supplier Part: C88419; Manufacturer: MICROCHIP(美国微芯); Supplier Footprint: SOT-23-5; JLCPCB Part Class: Extended Part; Datasheet: https://atta.szlcsc.com/upload/public/pdf/source/20180329/C95749_2D03E2CDCEE40DDAAF1BC13608301412.pdf; Supplier: LCSC; Maximum Input Voltage: 5.5V; Output Voltage: 3.3V; MAX Output Current: 300mA; Power Supply Rejection Ratio (PSRR): 60dB@(1kHz); Dropout Voltage: 380mV@(300mA); standby current: 55uA; Operating Temperature: -40℃~+125℃; Output Polarity: Positive electrode; Number of Outputs: 1
U11 = CH334F_C5187527: type:Hub USB Protocol:USB 2.0 Data Rate:480Mbps Voltage - Supply:5V；3.3V Voltage - Supply:5V；3.3V Operating Temperature:-40℃~+85℃ Operating Temperature:-40℃~+85℃; Supplier Part: C5187527; Manufacturer: WCH(南京沁恒); Supplier Footprint: QFN-24(4x4); JLCPCB Part Class: Extended Part; Datasheet: https://item.szlcsc.com/datasheet/CH334F/5860925.html; Supplier: LCSC; type: Hub; USB Protocol: USB 2.0; Data Rate: 480Mbps; Voltage - Supply: 5V；3.3V; Operating Temperature: -40℃~+85℃
U12 = SX3B12.000F1510F30: Type:Crystal Oscillator Frequency:12MHz Normal temperature Frequency Tolerance:±10ppm Normal temperature Frequency Tolerance:±10ppm Load Capacitance:15pF Frequency Stability:±30ppm Frequency Stability:±30ppm Equivalent Series Resistance(ESR):100Ω Operatin; LCSC Part Name: 12MHz ±10ppm 15pF; Supplier Part: C2901651; Manufacturer: SCTF(星通时频); Supplier Footprint: SMD3225-4P; JLCPCB Part Class: Extended Part; Datasheet: https://item.szlcsc.com/datasheet/SX3B12.000F1510F30/3151464.html; Supplier: LCSC; Type: Crystal Oscillator; Normal temperature Frequency Tolerance: ±10ppm; Load Capacitance: 15pF; Frequency Stability: ±30ppm; Equivalent Series Resistance(ESR): 100Ω; Operating Temperature: -40℃~+85℃
U14 = CH343P: Applications Function:USB to UART USB Protocol:USB 2.0 Number of Channels:- Voltage - Supply:3.3V；5V Voltage - Supply:3.3V；5V Data Rate:6Mbps Operating Temperature:-40℃~+85℃ Operating Temperature:-40℃~+85℃; Supplier Part: C2846043; Manufacturer: WCH(南京沁恒); Supplier Footprint: TQFN-16-EP(3x3); JLCPCB Part Class: Extended Part; Datasheet: https://item.szlcsc.com/datasheet/CH343P/3039795.html; Supplier: LCSC; Applications Function: USB to UART; USB Protocol: USB 2.0; Voltage - Supply: 3.3V；5V; Data Rate: 6Mbps; Operating Temperature: -40℃~+85℃
U15 = AMS1117-3.3_C347222: Output Type:Fixed Voltage - Supply:12V Output Voltage:3.3V Output Voltage:3.3V Output Current:1A Power Supply Rejection Ratio (PSRR):60dB@(120Hz) Voltage Dropout:1.3V@(1A) standby current:5mA Noise:0.003%Vout Features:Over Current Protection Operating Tem; LCSC Part Name: 输出:3.3V 电流:1A 耐压:12V; Supplier Part: C347222; Manufacturer: UMW(友台半导体); Supplier Footprint: SOT-223; JLCPCB Part Class: Extended Part; Datasheet: https://item.szlcsc.com/datasheet/AMS1117-3.3/323882.html; Supplier: LCSC; Output Type: Fixed; Voltage - Supply: 12V; Output Voltage: 3.3V; Output Current: 1A; Power Supply Rejection Ratio (PSRR): 60dB@(120Hz); Voltage Dropout: 1.3V@(1A); standby current: 5mA; Noise: 0.003%Vout; Features: Over Current Protection; Operating Temperature: -40℃~+125℃; Output Configuration: Positive; Number of Outputs: 1
U16 = MAX98357AETE+T: Class:Class D Speaker Channels:- Output Power:3.2W×1@4Ω Voltage - Supply:2.5V~5.5V Voltage - Supply:2.5V~5.5V Total Harmonic Distortion + Noise (THD+N):- Quiescent Current:2.4mA Operating Temperature:-40℃~+85℃ Operating Temperature:-40℃~+85℃ Power Supply; LCSC Part Name: 微型、低成本、PCM 类 D 级放大器具有 AB 级性能; Supplier Part: C910544; Manufacturer: ADI(亚德诺)/MAXIM(美信); Supplier Footprint: TQFN-16-EP(3x3); JLCPCB Part Class: Extended Part; Datasheet: https://item.szlcsc.com/datasheet/MAX98357AETE%252BT/978950.html; Supplier: LCSC; Class: Class D; Output Power: 3.2W×1@4Ω; Voltage - Supply: 2.5V~5.5V; Quiescent Current: 2.4mA; Operating Temperature: -40℃~+85℃; Power Supply Rejection Ratio (PSRR): 77dB; Efficiency: 92%
U18 U20 = HB-PH3-25417PB2GOP: Pin Structure:1x7P Pitch:2.54mm Row Spacing:2.54mm Circluar Pins/Square Pins:Pin Header Mounting Type:Through Hole Number of Rows:1 Number of Pins:7P Current Rating:3A Voltage Rating (Max):250V Length of Mating Pin:6mm Insulation Height:2.54mm Length of E; LCSC Part Name: 1x7P 间距:2.54mm 方针 直插; Supplier Part: C6332200; Manufacturer: HANBO(汉博); Supplier Footprint: 插件,P=2.54mm; JLCPCB Part Class: Extended Part; Datasheet: https://item.szlcsc.com/datasheet/HB-PH3-25417PB2GOP/7280440.html; Supplier: LCSC; Pin Structure: 1x7P; Pitch: 2.54mm; Row Spacing: 2.54mm; Circluar Pins/Square Pins: Pin Header; Mounting Type: Through Hole; Number of Rows: 1; Number of Pins: 7P; Current Rating: 3A; Voltage Rating (Max): 250V; Length of Mating Pin: 6mm; Insulation Height: 2.54mm; Length of End Connection Pin: 3mm; Contact Material: Brass; Contact Plating: Gold; Operating Temperature: -40℃~+105℃; Color: Black
U25 = S2B-XH-A-BK(LF)(SN): Pins Structure:1x2P Pitch:2.5mm Mounting Style:Bend insert Reference Series:XH Number of Pins:2P Number of Rows:1 Number of PINs Per Row:2 Row Spacing:- Current Rating (Max):3A Contact Material:Brass Contact Plating:Tin Operating Temperature Range:-25℃~+8; LCSC Part Name: 1x2P 间距:2.5mm 弯插 系列:XH; Supplier Part: C493111; Manufacturer: JST; Supplier Footprint: 弯插,P=2.5mm; JLCPCB Part Class: Extended Part; Datasheet: https://atta.szlcsc.com/upload/public/pdf/source/20210915/55C2150F8D01CCBD7F61D7DC07E45ED6.pdf; Supplier: LCSC; Pins Structure: 1x2P; Pitch: 2.5mm; Mounting Style: Bend insert; Reference Series: XH; Number of Pins: 2P; Number of Rows: 1; Number of PINs Per Row: 2; Current Rating (Max): 3A; Contact Material: Brass; Contact Plating: Tin; Operating Temperature Range: -25℃~+85℃; Rated Voltage (Max): 250V; Plastic Material: PA66; Flame Retardant Rating: UL94V-0; Supplementary Features: K-leg punch; Colour: Black; Z-Height of the Board: 6.1mm; X-Length of Bottom Edge on Board (Spacing Line): 7.4mm; Y-Width of Bottom Edge on Board: 11.5mm
U26 = XC6206P282MR_C5148690: Output Type:Fixed Voltage - Supply:6V Output Voltage:2.8V Output Voltage:2.8V Output Current:300mA Power Supply Rejection Ratio (PSRR):40dB@(1kHz) Voltage Dropout:240mV@(50mA) standby current:3uA Features:Short Circuit Protection；Over Current Protection O; LCSC Part Name: 输入8V 输出2.8V 300mA; Supplier Part: C5148690; Manufacturer: HXY MOSFET(华轩阳电子); Supplier Footprint: SOT-23; JLCPCB Part Class: Extended Part; Datasheet: https://item.szlcsc.com/datasheet/XC6206P282MR/5771927.html; Supplier: LCSC; Output Type: Fixed; Voltage - Supply: 6V; Output Voltage: 2.8V; Output Current: 300mA; Power Supply Rejection Ratio (PSRR): 40dB@(1kHz); Voltage Dropout: 240mV@(50mA); standby current: 3uA; Features: Short Circuit Protection；Over Current Protection; Operating Temperature: -40℃~+85℃; Output Configuration: Positive; Number of Outputs: 1
U28 = SSP7615-12MR: Output Type:Fixed Voltage - Supply:8V Output Voltage:1.2V Output Voltage:1.2V Output Current:400mA Power Supply Rejection Ratio (PSRR):60dB@(1kHz) Voltage Dropout:200mV@(100mA) standby current:450nA Features:Over Current Protection Operating Temperature:-; LCSC Part Name: 1.2V LDO; Supplier Part: C7545816; Manufacturer: Siproin(上海矽朋); Supplier Footprint: SOT-23-3; JLCPCB Part Class: Extended Part; Datasheet: https://item.szlcsc.com/datasheet/SSP7615-12MR/8658118.html; Supplier: LCSC; Output Type: Fixed; Voltage - Supply: 8V; Output Voltage: 1.2V; Output Current: 400mA; Power Supply Rejection Ratio (PSRR): 60dB@(1kHz); Voltage Dropout: 200mV@(100mA); standby current: 450nA; Features: Over Current Protection; Operating Temperature: -40℃~+85℃; Output Configuration: Positive; Number of Outputs: 1
X1 = CSTNE12M0G52A000R0: Frequency: Built-in Load Capacitance: Resonant Impedance: Operating Temperature:-40℃~+125℃ Operating Temperature:-40℃~+125℃; LCSC Part Name: 12MHz ±0.5% 内置负载电容:10pF; Supplier Part: C907957; Manufacturer: muRata(村田); Supplier Footprint: SMD3213-3P; JLCPCB Part Class: Extended Part; Datasheet: https://atta.szlcsc.com/upload/public/pdf/source/20201022/C907957_8E07C565874D4A99F6305262E18BC732.pdf; Supplier: LCSC; Operating Temperature: -40℃~+125℃

## Nets
1.2V: C46.1 C47.1 FPC3.15 U28.2(VOUT)
1V1: C5.2 C9.2 U7.23(DVDD) U7.45(VREG_VOUT) U7.50(DVDD)
2.8V: C43.2 C44.2 FPC3.21 U26.2(VOUT)
3V3: C4.2 C6.2 C7.2 C8.2 C11.2 C12.2 R8.2 U6.8(VCC) U7.1(IOVDD) U7.10(IOVDD) U7.22(IOVDD) U7.33(IOVDD) U7.42(IOVDD) U7.43(ADC_AVDD) U7.44(VREG_IN) U7.48(USB_VDD) U7.49(IOVDD) U8.5(VOUT)
3V3_OP: C16.2 C17.2 C22.1 C23.2 Q1.4(D2) U11.19(V5) U11.20(VDD33) U14.1(VIO) U14.3(VDD5)
GND: C1.1 C2.1 C3.2 C4.1 C5.1 C6.1 C7.1 C8.1 C9.1 C10.1 C11.1 C12.1 C13.1 C14.1 C16.1 C17.1 C18.2 C19.2 C21.2 C22.2 C23.1 C24.1 C25.1 C26.1 C27.1 C30.1 C32.1 C33.1 C34.1 C35.1 C36.1 C37.1 C38.1 C39.2 C40.1 C41.1 C42.1 C43.1 C44.1 C45.1 C46.2 C47.2 C48.2 CN1.3 CN1.4 CN4.1 CN4.4 CN4.7 CN4.8 ESPUSB.1(EH) ESPUSB.2(EH) ESPUSB.3(EH) ESPUSB.4(EH) ESPUSB.A1B12(GND) ESPUSB.B1A12(GND) FPC3.23 FPC3.25 FPC3.26 H8.4 H10.5 H10.7 LED1.1(K) LED2.2(K) LED3.2(K) MH1.1 MH2.1 MH3.1 MH4.1 PICOUSB.1(EH) PICOUSB.2(EH) PICOUSB.3(EH) PICOUSB.4(EH) PICOUSB.A1B12(GND) PICOUSB.B1A12(GND) Q1.5(S1) R11.1 R12.1 R16.2 R26.1 R27.1 R33.2 SW1.3 SW1.4 SW2.3 SW2.4 SW9.1 SW9.3 SW9.4 SW10.1 SW10.3 SW10.4 SW11.2 SW12.4 SW12.5 U1.1(GND) U1.40(GND) U1.41(GND) U2.5 U2.6 U4.5 U4.6 U5.5 U5.6 U6.4(GND) U7.19(TESTEN) U7.57(GND) U8.2(GND) U11.25(GND) U12.2(GND) U12.4(GND) U14.2(GND) U14.17(EP) U15.1(ADJ(GND)) U16.2(GAIN_SLOT) U16.3(GND) U16.11(GND) U16.15(GND) U16.17(EP) U20.6 U22.5 U22.6 U23.5 U23.6 U24.5 U24.6 U25.2 U26.1(VSS) U28.1(GND) X1.2
VBUS: C10.2 D1.2(A) D6.1(K) PICOUSB.A4B9(VBUS) PICOUSB.B4A9(VBUS)
VBUSINESP: C2.2 C27.2 C32.2 C34.2 C35.2 C36.2 D2.1(K) D3.1(K) R15.1 R28.2 U14.9(VBUS) U15.3(VIN) U16.7(VDD) U16.8(VDD)
#EN: C14.2 C25.2 Q3.3(C) R13.1 SW9.2 U1.3(EN)
CAMD0: FPC3.6 U1.19(IO11)
CAMD1: FPC3.4 U1.17(IO9)
CAMD2: FPC3.3 U1.12(IO8)
CAMD3: FPC3.5 U1.18(IO10)
CAMD4: FPC3.7 U1.20(IO12)
CAMD5: FPC3.9 U1.32(IO39)
CAMD6: FPC3.11 U1.33(IO40)
CAMD7: FPC3.13 U1.28(IO35)
CAMHREF: FPC3.16 U1.30(IO37)
CAMPCLK: C40.2 FPC3.8 U1.21(IO13)
CAMRST: C42.2 FPC3.19 R30.1
CAMSIOC: FPC3.20 R31.1 U1.24(IO47)
CAMSIOD: FPC3.22 R32.1 U1.25(IO48)
CAMVSYNC: FPC3.18 U1.29(IO36)
CAMXCLK: FPC3.12 U1.23(IO21)
D_N: ESPUSB.A7(DN1) ESPUSB.B7(DN2) U11.14(DMU)
D_P: ESPUSB.A6(DP1) ESPUSB.B6(DP2) U11.15(DPU)
DTR: Q2.2(E) R24.2 U14.12(DTRTNOW)
EIO0: R14.1 SW10.2 U1.27(IO0)
EIO1: C26.2 Q2.3(C) U1.39(IO1)
EIO2: U1.38(IO2)
EIO3: U1.15(IO3)
EIO7: H10.4 U1.7(IO7) U16.1(DIN)
EIO14: U1.22(IO14)
EIO15: H10.3 U1.8(IO15) U16.16(BCLK)
EIO16: H10.2 U1.9(IO16) U16.14(LRCLK)
EIO17: U1.10(IO17) U7.7(GPIO5)
EIO18: U1.11(IO18) U7.6(GPIO4)
EIO19: U1.13(IO19) U11.11(DM1)
EIO20: U1.14(IO20) U11.12(DP1)
EIO45: U1.26(IO45)
EIO46: U1.16(IO46)
EIORX: R22.1 U1.36(RXD0)
EIOTX: R23.1 U1.37(TXD0)
GPIO0: U7.2(GPIO0) U18.7
GPIO1: U7.3(GPIO1) U20.1
GPIO2: U7.4(GPIO2)
GPIO3: U7.5(GPIO3)
GPIO6: U7.8(GPIO6) U22.2
GPIO7: U7.9(GPIO7) U22.1
GPIO8: U2.2 U7.11(GPIO8)
GPIO9: U2.1 U7.12(GPIO9)
GPIO10: U7.13(GPIO10)
GPIO11: U7.14(GPIO11)
GPIO12: U5.2 U7.15(GPIO12)
GPIO13: U5.1 U7.16(GPIO13)
GPIO14: U4.2 U7.17(GPIO14)
GPIO15: U4.1 U7.18(GPIO15)
GPIO16: U7.27(GPIO16) U24.2
GPIO17: U7.28(GPIO17) U24.1
GPIO18: U7.29(GPIO18) U23.2
GPIO19: U7.30(GPIO19) U23.1
GPIO20: SW11.1 U7.31(GPIO20)
GPIO21: U7.32(GPIO21)
GPIO22: U7.34(GPIO22)
GPIO26: U7.38(GPIO26_ADC0)
GPIO27: U7.39(GPIO27_ADC1)
GPIO28: U7.40(GPIO28_ADC2)
MAXVDD: C13.2 C30.2 C33.2 C41.2 C45.2 C48.1 CN4.3 FPC3.14 H8.3 H10.6 H10.8 Q1.2(S2) R13.2 R14.2 R17.1 R21.2 R28.1 R30.2 R31.2 R32.2 U1.2(3V3) U15.2(VOUT(TAB)) U16.4(SD_MODE#) U26.3(VIN) U28.3(VIN)
MICSCK: CN4.5 U1.5(IO5)
MICSD: CN4.2 U1.6(IO6)
MICWS: CN4.6 U1.4(IO4)
MONSCL: H8.2 U1.35(IO42)
MONSDA: H8.1 U1.34(IO41)
NET15: L1.2 U16.9(OUTP)
NET16: L2.2 U16.10(OUTN)
PWDN: FPC3.17 R33.1
QSPI_SCLK: U6.6(CLK) U7.52(QSPI_SCLK)
QSPI_SD0: U6.5(DI/IO0) U7.53(QSPI_SD0)
QSPI_SD1: U6.2(DO/IO1) U7.55(QSPI_SD1)
QSPI_SD2: U6.3(WP#/IO2) U7.54(QSPI_SD2)
QSPI_SD3: U6.7(HOLD#/RESET#/IO3) U7.51(QSPI_SD3)
QSPI_SS: R9.2 U6.1(CS#) U7.56(QSPI_SS)
RGBPIN: U1.31(IO38)
RTS: Q3.2(E) R25.2 U14.13(RTS)
RUN: SW2.1 SW2.2 U7.26(RUN)
SWCLK: U7.24(SWCLK)
SWDIO: U7.25(SWD)
USB2_N: U11.9(DM2) U14.8(UD-)
USB2_P: U11.10(DP2) U14.7(UD+)
USB_DM: PICOUSB.A7(DN1) PICOUSB.B7(DN2) U7.46(USB_DM)
USB_DP: PICOUSB.A6(DP1) PICOUSB.B6(DP2) U7.47(USB_DP)
V+: C3.1 C21.1 C39.1 D7.1 U2.3 U2.4 U4.3 U4.4 U5.3 U5.4 U22.3 U22.4 U23.3 U23.4 U24.3 U24.4
VSYS: C1.2 D1.1(C) U8.1(VIN) U8.3(EN) U20.7
XI: C18.1 R19.2 U11.4(XI) U12.1
XO: R18.2 R19.1 U11.3(XO)
$1N1870: R9.1 SW1.1 SW1.2
$1N1872: U7.21(XOUT) X1.3
$1N1873: U7.20(XIN) X1.1
$1N1896: LED2.1(A) R7.1
$1N1897: R7.2 U7.37(GPIO25)
$1N2181: PICOUSB.B5(CC2) R12.2
$1N2182: PICOUSB.A5(CC1) R11.2
$1N3810: Q1.1(G1) R15.2 R16.1
$1N3984: Q1.3(G2) Q1.6(D1) R17.2
$1N4724: C19.1 R18.1 U12.3
$1N5316: LED3.1(A) R21.1
$1N6114: R22.2 U14.4(TXD)
$1N6119: R23.2 U14.5(RXD)
$1N6176: C24.2 U14.6(V3)
$1N6413: Q3.1(B) R24.1
$1N6452: Q2.1(B) R25.1
$1N6986: D3.2(A) ESPUSB.A4B9(VBUS) ESPUSB.B4A9(VBUS)
$1N7041: ESPUSB.A5(CC1) R26.2
$1N7109: ESPUSB.B5(CC2) R27.2
$1N7689: LED1.2(A) R8.1
$1N13425: C38.2 CN1.1 L1.1
$1N13429: C37.2 CN1.2 L2.1
$1N57692: D2.2(A) D6.2(A) D7.2 SW12.2
$1N57698: SW12.1 U25.1

Not connected (* = marked no-connect by the designer): ESPUSB A8(SBU1)* B8(SBU2)*; FPC3 1* 2* 10 24*; H10 1*; PICOUSB A8(SBU1)* B8(SBU2)*; SW11 3*; SW12 3; U7 35(GPIO23)* 36(GPIO24)* 41(GPIO29_ADC3)*; U8 4(NC)*; U11 1(OVCUR#)* 2(NC.)* 5(DM4)* 6(DP4)* 7(DM3)* 8(DP3)* 13(LED3/SCL)* 16(RESET#/CDP)* 17(NC)* 18(PSELF)* 21(LED4/SDA)* 22(LED1)* 23(LED2)* 24(PWREN#)*; U14 10(ACT#)* 11(DCD)* 14(DSR)* 15(CTS)* 16(RI)*; U15 4(TAB)*; U16 5(N.C.)* 6(N.C.)* 12(N.C.)* 13(N.C.)*; U18 1 2 3 4 5 6; U20 2 3 4 5

## Notes on the sheet
- Grove RX
- Pico TX
- Grove TX
- Pico RX
- ESP32-S3 N16R8
- RP2040
- RESET
- KEY_FLASH
- Grove Vision AI V2
- USB-C - Pico
- Key
- ESP
- ESP RX
- Pico TX1
- ESP
- ESP TX
- Pico RX1
- 3.3V Regulator
- ESP - Pico Bridge
- Grove
- Grove
- Servos
- Servos
- Servos
- Servos
- Mic Connector
- Monitor
- Monitor
- Servos
- Servos
- LR
- Servos
- WS
- Servos
- SCK
- Servos
- Servos
- Servos
- Servos
- Boot Switch
- Flash Memory
- Run Switch
- LEDs
- Hub
- Power
- SDA
- SCL
- 3V3
- GND
- ESP Monitor
- Debug Monitor
- Mounting Holes
- USB to UART
- Servos
- Calibration
  Switch
- Main
  Power
- Amplifier
- Main Camera
